# Altium project USB-PD_breakout.PrjPcb
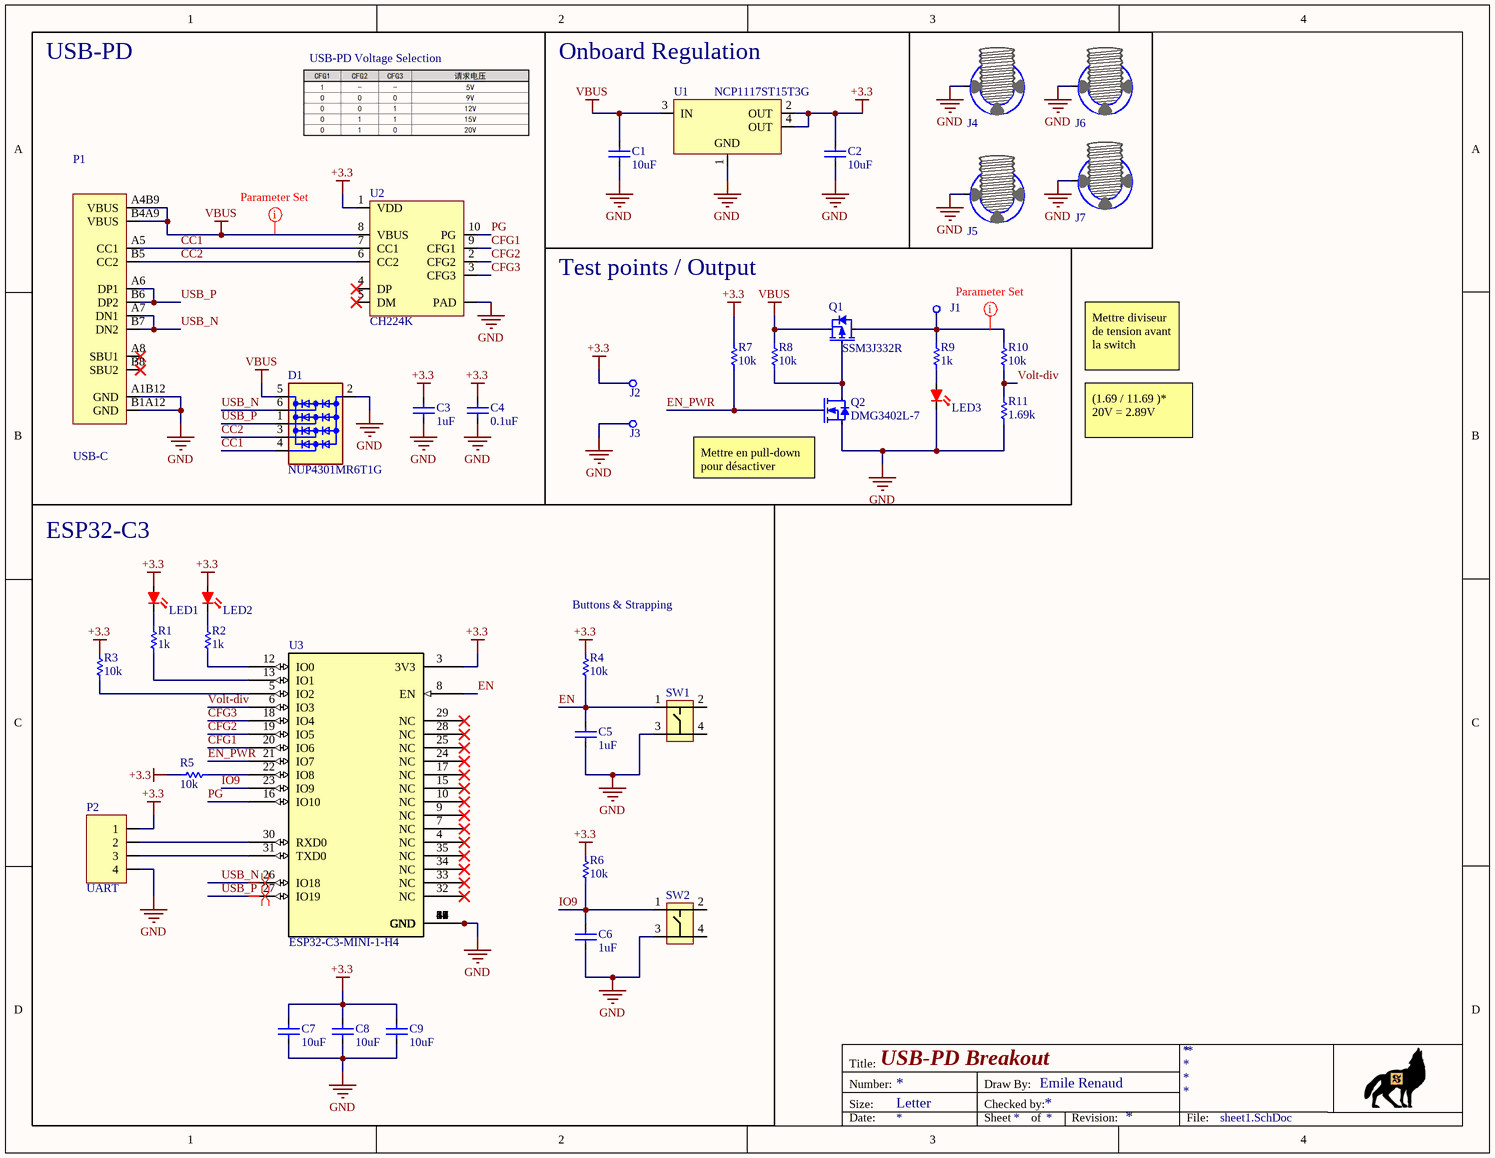
[diagram p0: sheet1.SchDoc]
1 sheet, 40 parts. Net scope: global (net labels, ports and power ports of the same name join across sheets).
Board file: PCB1.PcbDoc

## Sheet sheet1.SchDoc: USB-PD Breakout
size Letter; DrawnBy: Emile Renaud

### Parts
C1  value 10uF  [CAPACITOR-0805]  (hidden comment: Capacitor-0805-10uF-35V-X5R)
C2  value 10uF  [CAPACITOR-0805]  (hidden comment: Capacitor-0805-10uF-35V-X5R)
C3  value 1uF  [CAPACITOR-0603]  (hidden comment: Capacitor-0603-1uF-25V-X5R)
C4  value 0.1uF  [CAPACITOR-0603]  (hidden comment: Capacitor-0603-0.1uF-50V-X7R)
C5  value 1uF  [CAPACITOR-0603]  (hidden comment: Capacitor-0603-1uF-25V-X5R)
C6  value 1uF  [CAPACITOR-0603]  (hidden comment: Capacitor-0603-1uF-25V-X5R)
C7  value 10uF  [CAPACITOR-0805]  (hidden comment: Capacitor-0805-10uF-35V-X5R)
C8  value 10uF  [CAPACITOR-0805]  (hidden comment: Capacitor-0805-10uF-35V-X5R)
C9  value 10uF  [CAPACITOR-0805]  (hidden comment: Capacitor-0805-10uF-35V-X5R)
D1  NUP4301MR6T1G  [SOT-23-6]
J1  hole  [HOLE-2.70MM]  (value not drawn)  (no BOM)
J2  hole  [HOLE-2.70MM]  (value not drawn)  (no BOM)
J3  hole  [HOLE-2.70MM]  (value not drawn)  (no BOM)
J4  hole  [HOLE-3.40MM-M3-7MMEYELET-MountingFeature]  (value not drawn)  (no BOM)
J5  hole  [HOLE-3.40MM-M3-7MMEYELET-MountingFeature]  (value not drawn)  (no BOM)
J6  hole  [HOLE-3.40MM-M3-7MMEYELET-MountingFeature]  (value not drawn)  (no BOM)
J7  hole  [HOLE-3.40MM-M3-7MMEYELET-MountingFeature]  (value not drawn)  (no BOM)
LED1  B1911USD-20D000114U1930  [LED-0603-2PIN]  (value not drawn)
LED2  B1911USD-20D000114U1930  [LED-0603-2PIN]  (value not drawn)
LED3  B1911USD-20D000114U1930  [LED-0603-2PIN]  (value not drawn)
P1  USB-C  [USB-C]
P2  UART  [HDR1X4]
Q1  SSM3J332R  [SOT-23-3]
Q2  DMG3402L-7  [SOT-23-3]
R1  value 1k  [Resistor-0603]  (hidden comment: SMT resistor)
R2  value 1k  [Resistor-0603]  (hidden comment: SMT resistor)
R3  value 10k  [Resistor-0603]  (hidden comment: SMT resistor)
R4  value 10k  [Resistor-0603]  (hidden comment: SMT resistor)
R5  value 10k  [Resistor-0603]  (hidden comment: SMT resistor)
R6  value 10k  [Resistor-0603]  (hidden comment: SMT resistor)
R7  value 10k  [Resistor-0603]  (hidden comment: SMT resistor)
R8  value 10k  [Resistor-0603]  (hidden comment: SMT resistor)
R9  value 1k  [Resistor-0603]  (hidden comment: SMT resistor)
R10  value 10k  [Resistor-0603]  (hidden comment: SMT resistor)
R11  value 1.69k  [Resistor-0603]  (hidden comment: SMT resistor)
SW1  PTS815 SJM 250 SMTR LFS  [SW4_PTS815 SJM 250 SMTR LFS_CNK]  (value not drawn)
SW2  PTS815 SJM 250 SMTR LFS  [SW4_PTS815 SJM 250 SMTR LFS_CNK]  (value not drawn)
U1  NCP1117ST15T3G  [SOT-223-3/TO-261-3S]
U2  CH224K  [SOP10-PAD]
U3  ESP32-C3-MINI-1-H4  [ESP32-C3-MINI-1_EXP]

### Blocks framed on the sheet
USB-PD: C3 C4 D1 P1 U2

### Nets
+3.3: C2.2 C3.2 C4.2 C7.2 C8.2 C9.2 J2.1 LED1.2(R) LED2.2(R) P2.1 R3.2 R4.2 R5.2 R6.2 R7.2 U1.2(OUT) U1.4(OUT) U2.1(VDD) U3.3(3V3)
GND: C1.1 C2.1 C3.1 C4.1 C5.1 C6.1 C7.1 C8.1 C9.1 D1.2(GND) J3.1 J4.1 J5.1 J6.1 J7.1 LED3.1(K) P1.A1B12(GND) P1.B1A12(GND) P2.4 Q2.2(S) R11.1 SW1.3 SW2.3 U1.1(GND) U2.PAD U3.1(GND) U3.2(GND) U3.11(GND) U3.14(GND) U3.36(GND) U3.37(GND) U3.38(GND) U3.39(GND) U3.40(GND) U3.41(GND) U3.42(GND) U3.43(GND) U3.44(GND) U3.45(GND) U3.46(GND) U3.47(GND) U3.48(GND) U3.49(GND) U3.50(GND) U3.51(GND) U3.52(GND) U3.53(GND) U3.54(GND) U3.55(GND) U3.56(GND) U3.57(GND) U3.58(GND) U3.59(GND) U3.60(GND) U3.61(GND)
VBUS: C1.2 D1.5(VDD) P1.A4B9(VBUS) P1.B4A9(VBUS) Q1.2(S) R8.2 U1.3(IN) U2.8(VBUS)
CC1: D1.4(L4) P1.A5(CC1) U2.7(CC1)
CC2: D1.3(L3) P1.B5(CC2) U2.6(CC2)
CFG1: U2.9(CFG1) U3.20(IO6)
CFG2: U2.2(CFG2) U3.19(IO5)
CFG3: U2.3(CFG3) U3.18(IO4)
EN: C5.2 R4.1 SW1.1 U3.8(EN)
EN_PWR: Q2.1(G) R7.1 U3.21(IO7)
IO9: C6.2 R6.1 SW2.1 U3.23(IO9)
PG: U2.10(PG) U3.16(IO10)
USB_N: D1.6(L1) P1.A7(DN1) P1.B7(DN2) U3.26(IO18)
USB_P: D1.1(L2) P1.A6(DP1) P1.B6(DP2) U3.27(IO19)
Volt-div: R10.1 R11.2 U3.6(IO3)
NetJ1_1: J1.1 Q1.3(D) R9.2 R10.2
NetLED1_1: LED1.1(K) R1.2
NetLED2_1: LED2.1(K) R2.2
NetLED3_2: LED3.2(R) R9.1
NetP2_2: P2.2 U3.30(RXD0)
NetP2_3: P2.3 U3.31(TXD0)
NetQ1_1: Q1.1(G) Q2.3(D) R8.1
NetR1_1: R1.1 U3.13(IO1)
NetR2_1: R2.1 U3.12(IO0)
NetR3_1: R3.1 U3.5(IO2)
NetR5_1: R5.1 U3.22(IO8)

Not connected (* = marked no-connect by the designer): P1 A8(SBU1)* B8(SBU2)*; SW1 2 4; SW2 2 4; U2 4(DP)* 5(DM)*; U3 4(NC)* 7(NC)* 9(NC)* 10(NC)* 15(NC)* 17(NC)* 24(NC)* 25(NC)* 28(NC)* 29(NC)* 32(NC)* 33(NC)* 34(NC)* 35(NC)*

### Layout directives
net class Power: NetJ1_1, VBUS
differential pair: USB_N, USB_P

### Notes on the sheet
- USB-PD Voltage Selection
- (near U1) Onboard Regulation
- Test points / Output
- Mettre diviseur de tension avant la switch
- (1.69 / 11.69 )* 20V = 2.89V
- (near Q2) Mettre en pull-down pour désactiver toujours
- (near LED1) ESP32-C3
- (near R4) Buttons & Strapping
- Title:
- Size:
- Number:
- Letter
- Draw By:
- Checked by:
- Date:
- Sheet
- of
- Revision:
- File:

### Library data of the parts
C1 C2 C7-C9 = Capacitor-0805-10uF-35V-X5R: Precision: X5R-10%; Volt: 35V; Package / Case: Metric 2012 , EIA 0805; Mounted: Yes; Supplier 1: Digi-Key; Supplier Part Number 1: 490-10515-1-ND; Supplier 2: Digi-Key; Supplier 3: Digi-Key; Supplier 4: Digi-Key
C3 C5 C6 = Capacitor-0603-1uF-25V-X5R: Precision: X5R-10%; Volt: 25V; Package / Case: Metric 1608, EIA 0603; Mounted: Yes; Supplier 1: Digi-Key; Supplier Part Number 1: 1276-1859-2-ND; Supplier 2: Digi-Key; Supplier 3: Digi-Key; Supplier 4: Digi-Key; Supplier Part Number 2: 1276-1942-2-ND
C4 = Capacitor-0603-0.1uF-50V-X7R: Precision: X7R-10%; Volt: 50V; Package / Case: Metric 1608, EIA 0603; Mounted: Yes; Supplier 1: Digi-Key; Supplier Part Number 1: 1276-1935-2-ND; Supplier 2: Digi-Key; Supplier 3: Digi-Key; Supplier 4: Digi-Key; Supplier Part Number 2: 1276-1934-2-ND
D1 = NUP4301MR6T1G: 4CH Clamp Ipp Tvs Diode Surface Mount SOT23-6 (SC74); Volt: 70; Supplier 1: Digi-Key; Supplier Part Number 1: NUP4301MR6T1GOSTR-ND; Mounted: Yes; Package / Case: SOT23-6
J1-J3 = Hole 2.70mm AWG12-Stranded: Hole for 12 AWG Stranded Wire; Mounted: N/A
J4-J7 = Hole 3.40mm M3-MountingFeature: Hole for M3 Bolt with 7mm pad; Mounted: N/A
LED1-LED3 = B1911USD-20D000114U1930: LED RED CLEAR 1608 SMD; Package / Case: 0603 (1608 Metric); Mounted: Yes; Supplier 1: Digi-Key; Supplier Part Number 1: 3147-B1911USD-20D000114U1930CT-ND
P1 = USB-C: TYPEC-304J-BCP16 / 5A USB 3.1 1 Type-C SMD USB Connectors; Supplier 1: LCSC; Supplier Part Number 1: TYPEC-304J-BCP16; Mounted: Yes; Package / Case: SMD; Volt: N/A
P2 = 4pos-TH-2.54mm: 4pos TH 2.54mm Header; Supplier 1: Digi-Key; Supplier Part Number 1: N/A; Mounted: Yes; Package / Case: TH; Volt: N/A
Q1 = SSM3J332R: P-Channel 30 V 6A (Ta) 1W (Ta) Surface Mount SOT-23F; Volt: 30V; Supplier 1: Digi-Key; Supplier Part Number 1: SSM3J332RLFCT-ND; Package / Case: SOT-523; Mounted: Yes; Current: 6A
Q2 = DMG3402L-7: N-Channel 30 V 4A (Ta) 1.4W (Ta) Surface Mount SOT-23-3; Volt: 30V; Supplier 1: Digi-Key; Supplier Part Number 1: DMG3402L-7DICT-ND; Package / Case: SOT-23-3; Mounted: Yes; Current: 4A
R1 R2 R9 = Resistor0603-1k: Precision: 1%; Watt: 0.1W; Mounted: Yes; Package / Case: Metric 1608, EIA 0603; Supplier 2: Digi-Key; Supplier 4: Digi-Key; Supplier Part Number 2: 311-1.00KHRTR-ND; Supplier 1: Digi-Key; Supplier 3: Digi-Key; Supplier Part Number 1: RMCF0603FT1K00TR-ND; Supplier Part Number 3: AG1307TR-ND
R3-R8 R10 = Resistor0603-10k: Precision: 1%; Watt: 0.1W; Mounted: Yes; Package / Case: Metric 1608, EIA 0603; Supplier 2: Digi-Key; Supplier 4: Digi-Key; Supplier Part Number 2: RMCF0603FT10K0TR-ND; Supplier 1: Digi-Key; Supplier 3: Digi-Key; Supplier Part Number 1: 311-10.0KHRTR-ND
R11 = Resistor0603-1.69k: Precision: 1%; Watt: 0.25W; Mounted: Yes; Package / Case: Metric 1608, EIA 0603; Supplier 2: Digi-Key; Supplier 4: Digi-Key; Supplier 1: Digi-Key; Supplier 3: Digi-Key; Supplier Part Number 1: RMCF0603FT1K69CT-ND
SW1 SW2 = PTS815 SJM 250 SMTR LFS: TACT 4.2 X 3.2, 2.5 MM H, 180GF,; Volt: 12V; Current: 0.05A; Supplier 1: Digi-Key; Supplier Part Number 1: CKN12215-1-ND; Mounted: Yes
U1 = NCP1117ST15T3G: IC REG LINEAR 3.3V 1A SOT223; Supplier 1: Digi-Key; Supplier Part Number 1: NCV1117ST33T3GOSCT-ND; Package / Case: SOT223; Mounted: Yes
U2 = CH224K: IC USB-PD Controller / ESSOP-10; Grade: None; Supplier 1: LCSC; Supplier Part Number 1: C970725; Package / Case: ESSOP-10; Mounted: Yes
U3 = ESP32-C3-MINI-1-N4: Bluetooth, WiFi 802.11b/g/n, Bluetooth v5.0 Transceiver Module 2.412GHz ~ 2.484GHz PCB Trace Surface Mount; Mfr_Name: Espressif Systems; Copyright: Copyright (C) 2023 Ultra Librarian. All rights reserved.; Manufacturer_Part_Number: ESP32-C3-MINI-1-N4; RefDes: RefDes; Type: Type; Datasheet: https://www.espressif.com/sites/default/files/documentation/esp32-c3-mini-1_datasheet_en.pdf